# EAGLE schematic rolladen-aktor (EAGLE 7.6.0)
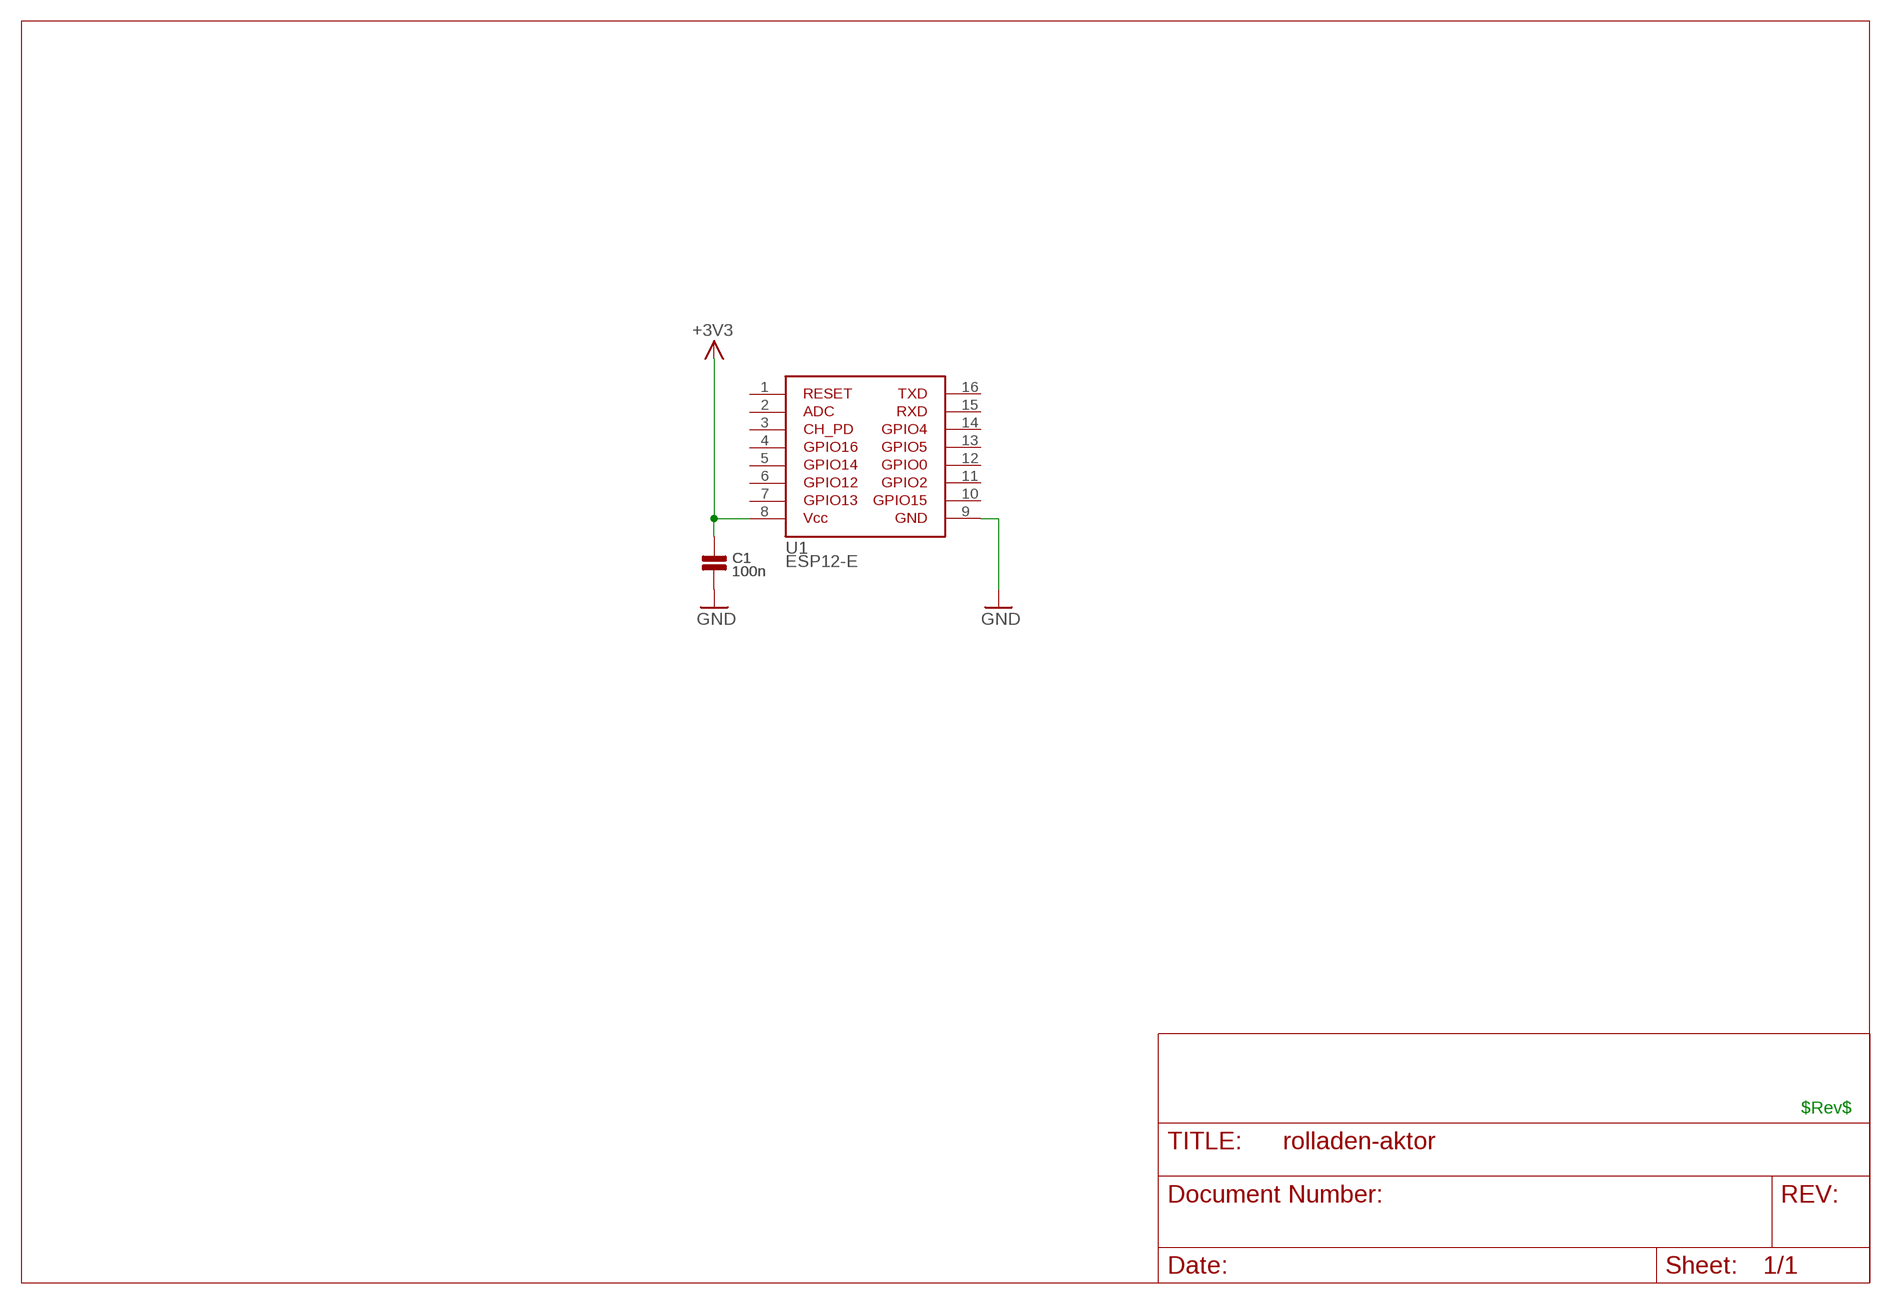
[diagram p0: schematic, sheet 1]

## Parts
C1  C_KER_100N_1206  [U_SMT_1206]
U1  U_MIC_ESP12_ESP12-E_ESP12  [U_MIC_ESP12]

## Nets
+3V3: C1.1 U1.8
GND: C1.2 U1.9
Unconnected: U1.1 U1.2 U1.3 U1.4 U1.5 U1.6 U1.7 U1.10 U1.11 U1.12 U1.13 U1.14 U1.15 U1.16

## Notes on the sheet
- $Rev$

## Library data of the parts
C1 = C_KER:C_KER_*_?: Keramik-Kondensator; VALUE_1: 100n; VALUE_2: 50V; 10%; X7R
U1 = U_MIC:U_MIC_ESP12_*_?: WLAN Controller; VALUE_1: ESP12-E